# EAGLE design fabpdi-mega8 (EAGLE 8.1.0)
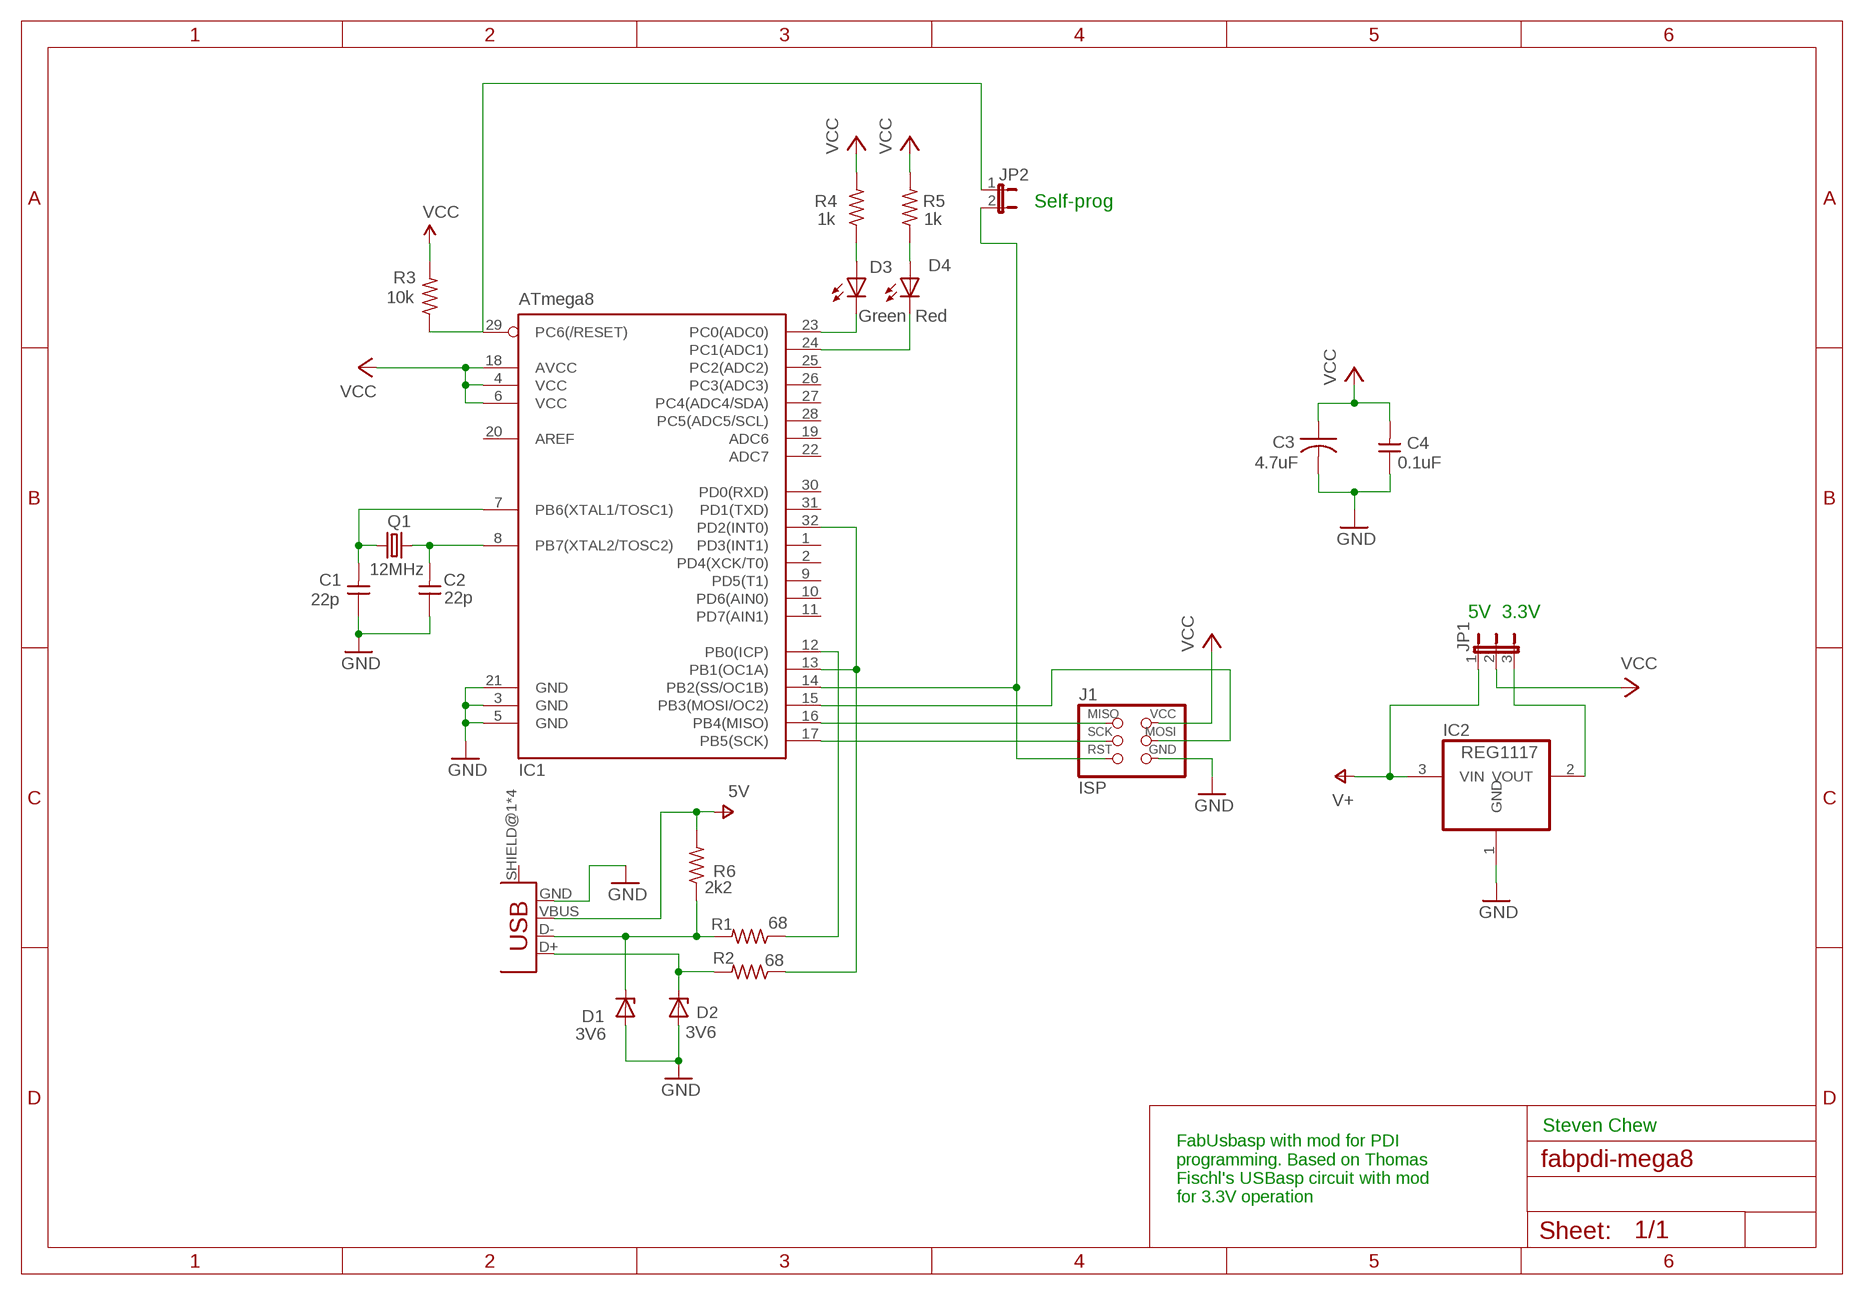
[diagram p0: schematic, sheet 1]

## Parts
C1  22p  CAP-UNPOLARIZEDFAB  [C1206FAB]
C2  22p  CAP-UNPOLARIZEDFAB  [C1206FAB]
C3  4.7uF  CAP-US1206FAB  [C1206FAB]
C4  0.1uF  CAP-UNPOLARIZEDFAB  [C1206FAB]
D1  3V6  ZENER_DIODESOD123  [SOD123]
D2  3V6  ZENER_DIODESOD123  [SOD123]
D3  Green  LEDFAB1206  [LED1206FAB]
D4  Red  LEDFAB1206  [LED1206FAB]
IC1  ATmega8  ATMEGA88-THIN  [TQFP32-08THIN]
IC2  REG1117  [SOT223]
J1  ISP  AVRISPSMD  [2X03SMD]
JP1  JP2E  [JP2]
JP2  JP1E  [JP1]
Q1  12MHz  CRYSTAL  [2-SMD-5X3MM]
R1  68  RES-US1206FAB  [R1206FAB]
R2  68  RES-US1206FAB  [R1206FAB]
R3  10k  RES-US1206FAB  [R1206FAB]
R4  1k  RES-US1206FAB  [R1206FAB]
R5  1k  RES-US1206FAB  [R1206FAB]
R6  2k2  RES-US1206FAB  [R1206FAB]
U$1  USB_MINIB  [USB_MINIB]

## Nets
GND: C1.1 C2.1 C3.2 C4.1 D1.ANODE D2.ANODE IC1.3(GND) IC1.5(GND) IC1.21(GND) IC2.1(GND) J1.6(GND) U$1.GND
N$1: C2.2 IC1.8(PB7(XTAL2/TOSC2)) Q1.P$2
N$2: C1.2 IC1.7(PB6(XTAL1/TOSC1)) Q1.P$1
N$3: IC1.12(PB0(ICP)) R1.1
N$4: D1.CATHODE R1.2 R6.1 U$1.D-
N$5: D2.CATHODE R2.2 U$1.D+
N$6: D3.2(C) IC1.23(PC0(ADC0))
N$7: IC1.16(PB4(MISO)) J1.1(MISO)
N$8: IC1.17(PB5(SCK)) J1.3(SCK)
N$9: IC1.15(PB3(MOSI/OC2)) J1.4(MOSI)
N$10: IC1.29(PC6(/RESET)) JP2.1 R3.1
N$11: D3.1(A) R4.1
N$12: D4.2(C) IC1.24(PC1(ADC1))
N$13: D4.1(A) R5.1
N$14: IC1.14(PB2(SS/OC1B)) J1.5(RST) JP2.2
N$15: IC1.13(PB1(OC1A)) IC1.32(PD2(INT0)) R2.1
N$17: IC2.2(VOUT) JP1.3
V+: IC2.3(VIN) JP1.1 R6.2 U$1.VBUS ; supply symbol labelled 5V
VCC: C3.1 C4.2 IC1.4(VCC) IC1.6(VCC) IC1.18(AVCC) J1.2(VCC) JP1.2 R3.2 R4.2 R5.2
Unconnected: IC1.1(PD3(INT1)) IC1.2(PD4(XCK/T0)) IC1.9(PD5(T1)) IC1.10(PD6(AIN0)) IC1.11(PD7(AIN1)) IC1.19(ADC6) IC1.20(AREF) IC1.22(ADC7) IC1.25(PC2(ADC2)) IC1.26(PC3(ADC3)) IC1.27(PC4(ADC4/SDA)) IC1.28(PC5(ADC5/SCL)) IC1.30(PD0(RXD)) IC1.31(PD1(TXD)) U$1.SHIELD@1(SHIELD) U$1.SHIELD@2(SHIELD) U$1.SHIELD@3(SHIELD) U$1.SHIELD@4(SHIELD)

## Notes on the sheet
- Self-prog
- 5V  3.3V
- Steven Chew
- FabUsbasp with mod for PDI
  programming. Based on Thomas
  Fischl's USBasp circuit with mod
  for 3.3V operation

## Library data of the parts
C1 C2 C4 = 00fab:CAP-UNPOLARIZED
C3 = 00fab:CAP-US
D1 D2 = 00fab:ZENER_DIODE: zener diode
D3 D4 = 00fab:LED: LED
IC1 = 00fab:ATMEGA88-THIN
IC2 = burr-brown:REG1117: 800mA and 1A Low Dropout (LDO) Positive Regulator 1.8V, 2.5V, 2.85V, 3.3V, 5V, and Adj; MPN: REG1117; OC_FARNELL: 1097566; OC_NEWARK: 14P6981
J1 = 00fab:AVRISP
JP1 = jumper:JP2E: JUMPER
JP2 = jumper:JP1E: JUMPER
Q1 = 00fab:CRYSTAL
R1-R6 = 00fab:RES-US: Resistor (US Symbol) Variants with postfix FAB are widened to allow the routing of internal traces
U$1 = 00fab:USB_MINIB

## Board
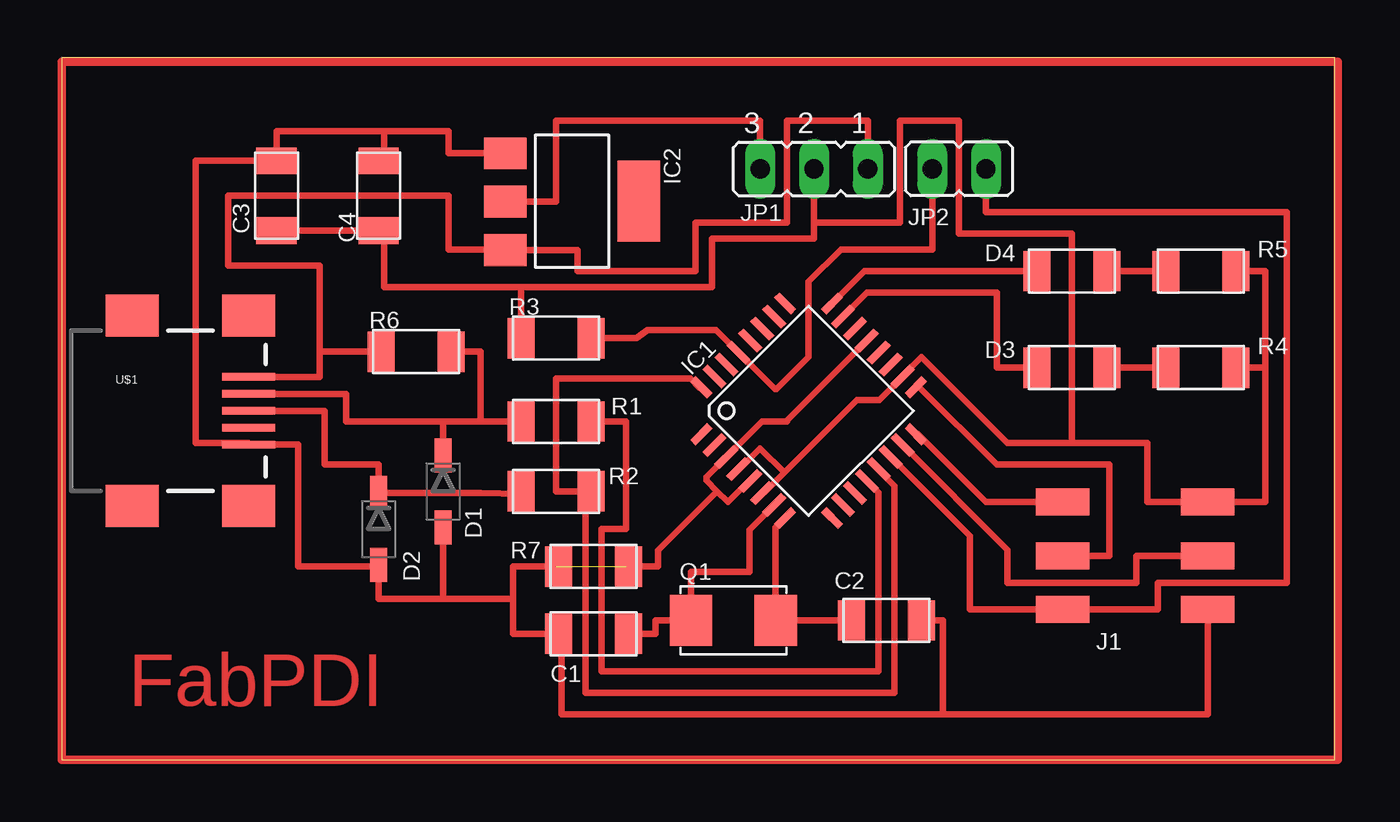
[diagram p1: board, top side]

Size 60.18 x 33.2 mm. Coordinates in mm from the lower left corner, seen from the top.
Outline: 0,0 60.18,0 60.18,33.2 0,33.2 0,0
Copper layers (1*16): Top 0.035mm / dielectric 1.5mm / Bottom 0.035mm
Design rules "default *": minimum track width 10mil, minimum drill 24mil, track to track 10mil, track to pad 10mil, pad to pad 10mil, via to via 10mil, smd to smd 8mil, copper to edge 40mil, drill to drill 8mil, minimum pad ring 10mil, minimum via ring 8mil, stop-mask expansion 4mil, vias tented up to drill 0mil, thermal gap 10mil

### Footprints (pad centres in the part's own frame; a part is rotated, then mirrored left to right if it is on the bottom)
C1206FAB = smd 1.27 x 1.905: 1 -1.651,0; 2 1.651,0
SOD123 = smd 1.6 x 0.8: ANODE 1.7,0; CATHODE -1.7,0
LED1206FAB = smd 1.27 x 1.905: 1 -1.651,0; 2 1.651,0
TQFP32-08THIN = smd 1.118 x 0.356: 1 -4.369,2.8; 8 -4.369,-2.8; 17 4.369,-2.8; 24 4.369,2.8 | smd 1.27 x 0.356: 2 -4.293,2; 3 -4.293,1.2; 4 -4.293,0.4; 5 -4.293,-0.4; 6 -4.293,-1.2; 7 -4.293,-2; 18 4.293,-2; 19 4.293,-1.2; 20 4.293,-0.4; 21 4.293,0.4; 22 4.293,1.2; 23 4.293,2 | smd 0.356 x 1.118: 9 -2.8,-4.369; 16 2.8,-4.369; 25 2.8,4.369; 32 -2.8,4.369 | smd 0.356 x 1.27: 10 -2,-4.293; 14 1.2,-4.293; 15 2,-4.293; 26 2,4.293; 27 1.2,4.293; 31 -2,4.293 | smd 0.35 x 1.27: 11 -1.2,-4.293; 12 -0.4,-4.293; 13 0.4,-4.293; 28 0.4,4.293; 29 -0.4,4.293; 30 -1.2,4.293
SOT223 = smd 1.499 x 2.007: 1 -2.261,-3.15; 2 0.025,-3.15; 3 2.311,-3.15 | smd 3.81 x 2.007: 4 0,3.15
2X03SMD = smd 2.54 x 1.27: 1 -3.493,2.54; 2 3.365,2.54; 3 -3.493,0; 4 3.365,0; 5 -3.493,-2.54; 6 3.365,-2.54
JP2 = drill 0.914 long: 1 -2.54,0; 2 0,0; 3 2.54,0
JP1 = drill 0.914 long: 1 0,-1.27; 2 0,1.27
2-SMD-5X3MM = smd 2 x 2.4: P$1 -2,0; P$2 2,0
R1206FAB = smd 1.27 x 1.905: 1 -1.651,0; 2 1.651,0
USB_MINIB = smd 2.5 x 0.35: D+ 3.77,0; D- 3.77,0.8; GND 3.77,-1.6; ID 3.77,-0.8; VBUS 3.77,1.6 | smd 2.5 x 2: SHIELD@1 -1.73,-4.5; SHIELD@2 -1.73,4.5; SHIELD@3 3.77,4.5; SHIELD@4 3.77,-4.5

### Placement (x,y rotation side)
C1  25.15,5.97 0 top
C2  38.99,6.6 180 top
C3  10.16,26.67 90 top
C4  14.99,26.67 270 top
D1  18.03,12.7 270 top
D2  14.99,10.92 270 top
D3  47.75,18.54 180 top
D4  47.75,23.11 180 top
IC1  35.31,16.51 45 top
IC2  24.13,26.42 270 top
J1  50.8,9.65 0 top
JP1  35.56,27.94 180 top
JP2  42.42,27.94 270 top
Q1  31.75,6.6 0 top
R1  23.37,16 180 top
R2  23.37,12.7 180 top
R3  23.37,19.94 180 top
R4  53.85,18.54 0 top
R5  53.85,23.11 0 top
R6  16.76,19.3 180 top
R7  0  [R1206FAB]  25.15,9.14 0 top
U$1  5.08,16.51 0 top

### Tracks (layer width: path | path; a pad name or v marks a point on that pad's centre or on a via)
GND  (1 unrouted)
  Top 0.305: 18.03,7.62 D1.ANODE | 18.03,7.62 21.34,7.62 | C1.1 23.5,6.35 | 18.03,7.62 14.99,7.62 D2.ANODE 14.99,9.14 11.18,9.14 11.18,14.91 U$1.GND 8.85,14.99 6.35,14.99 6.35,28.32 C3.2 10.16,29.72 15.24,29.72 | C2.1 41.66,6.6 41.66,2.16 | 41.66,2.16 54.16,2.16 J1.6 | C1.1 23.62,6.6 23.62,2.16 41.66,2.16 | IC2.1 18.29,28.68 18.29,29.72 15.24,29.72 | C4.1 15.24,28.32 15.24,29.72 | IC1.21 34.29,16.06 34.29,16 33.1,16 IC1.3 30.48,13.38 30.48,13.21 30.99,12.7 | 23.37,9.14 21.34,9.14 21.34,7.62 | 21.34,7.62 21.34,5.97 C1.1 | IC1.5 32.5,13.19 31.5,12.19 30.99,12.7 | 30.99,12.7 28.19,9.91 28.19,9.14 26.67,9.14
N$1
  Top 0.305: IC1.8 33.75,10.99 Q1.P$2 C2.2
N$2
  Top 0.305: IC1.7 32.51,10.89 32.51,8.89 29.75,8.89 Q1.P$1 28.07,6.6 28.07,5.97 C1.2
N$3
  Top 0.305: IC1.12 38.61,12.64 38.61,4.19 25.53,4.19 25.53,10.92 26.67,10.92 26.67,16 R1.1
N$4
  Top 0.305: D1.CATHODE 18.03,15.75 18.03,16 | 19.81,16 18.03,16 | 19.81,16 R1.2 | R6.1 19.81,19.3 19.81,16 | U$1.D- 13.46,17.31 13.46,16 18.03,16
N$5
  Top 0.305: R2.2 21.72,12.57 19.81,12.62 D2.CATHODE 14.99,13.97 12.45,13.97 12.45,16.51 U$1.D+
N$6
  Top 0.305: D3.2 44.2,18.54 44.2,22.1 38.07,22.1 IC1.23
N$7
  Top 0.305: IC1.16 40.48,15.4 43.69,12.19 J1.1
N$8
  Top 0.305: IC1.17 40.55,17.62 44.2,13.97 49.53,13.97 49.53,9.65 J1.3
N$9
  Top 0.305: IC1.15 44.7,9.94 44.7,8.38 50.8,8.38 50.8,9.65 J1.4
N$10
  Top 0.305: R3.1 27.18,19.94 27.69,20.32 30.93,20.32 IC1.29 33.72,17.53 33.78,17.53 35.31,19.05 35.31,22.61 36.83,24.13 41.15,24.13 JP2.1
N$11
  Top 0.305: D3.1 R4.1
N$12
  Top 0.305: D4.2 37.95,23.11 IC1.24
N$13
  Top 0.305: D4.1 R5.1
N$14
  Top 0.305: IC1.14 42.93,10.59 42.93,7.11 J1.5 51.82,7.11 51.82,8.38 57.91,8.38 57.91,25.91 43.69,25.91 JP2.2
N$15
  Top 0.305: IC1.32 30.13,17.62 29.72,18.03 23.37,18.03 23.37,12.7 24.77,12.7 | IC1.13 38.62,13.7 39.37,12.95 39.37,3.17 24.77,3.17 24.77,12.7 | 24.77,12.7 R2.1
N$16
  Top 0.406: 0,0 60.33,0 60.33,33.02 0,33.02 0,0
N$17
  Top 0.305: IC2.2 23.37,26.39 23.37,30.23 33.02,30.23 JP1.3
V+
  Top 0.305: U$1.VBUS 12.19,18.11 12.19,19.05 12.19,19.3 | JP1.1 38.1,30.23 34.29,30.23 34.29,25.4 29.97,25.4 29.97,23.11 24.38,23.11 24.38,24.11 IC2.3 20.98,24.13 18.29,24.13 18.29,26.67 7.87,26.67 7.87,23.37 12.19,23.37 12.19,19.3 | R6.2 12.19,19.3
VCC
  Top 0.305: IC1.4 32.05,13.76 33.02,14.73 34.16,13.59 | IC1.6 33.25,12.67 34.16,13.59 | C3.1 C4.2 15.24,25.02 15.24,22.35 21.72,22.35 | 21.72,22.35 30.73,22.35 30.73,24.64 35.56,24.64 35.56,25.4 | R3.2 21.72,22.1 21.72,22.35 | 56.9,18.54 56.9,12.19 J1.2 51.31,12.19 51.31,14.99 47.75,14.99 | 56.9,18.54 56.9,23.11 R5.2 | R4.2 56.9,18.54 | 34.16,13.59 37.59,17.02 38.64,17.02 IC1.18 39.76,18.17 40.64,19.05 44.7,14.99 47.75,14.99 | 35.56,25.4 JP1.2 | 35.56,25.4 39.62,25.4 39.62,30.23 42.42,30.23 42.42,24.89 47.75,24.89 47.75,14.99

### Text on the board
Top: FabPDI